# Altium schematic sheet 1166V30-1.SchDoc: 3 Phasen Motor-Modul
size A3; Author: M. Kutzsche; Organization: Kübrich Ing.-Gesellschaft; Address1: mbH & Co. KG; Address2: Weißmühle 10; Address3: D-96170 Priesendorf; DocumentNumber: UltraZohm; Revision: 30; SheetNumber: 1; SheetTotal: 5
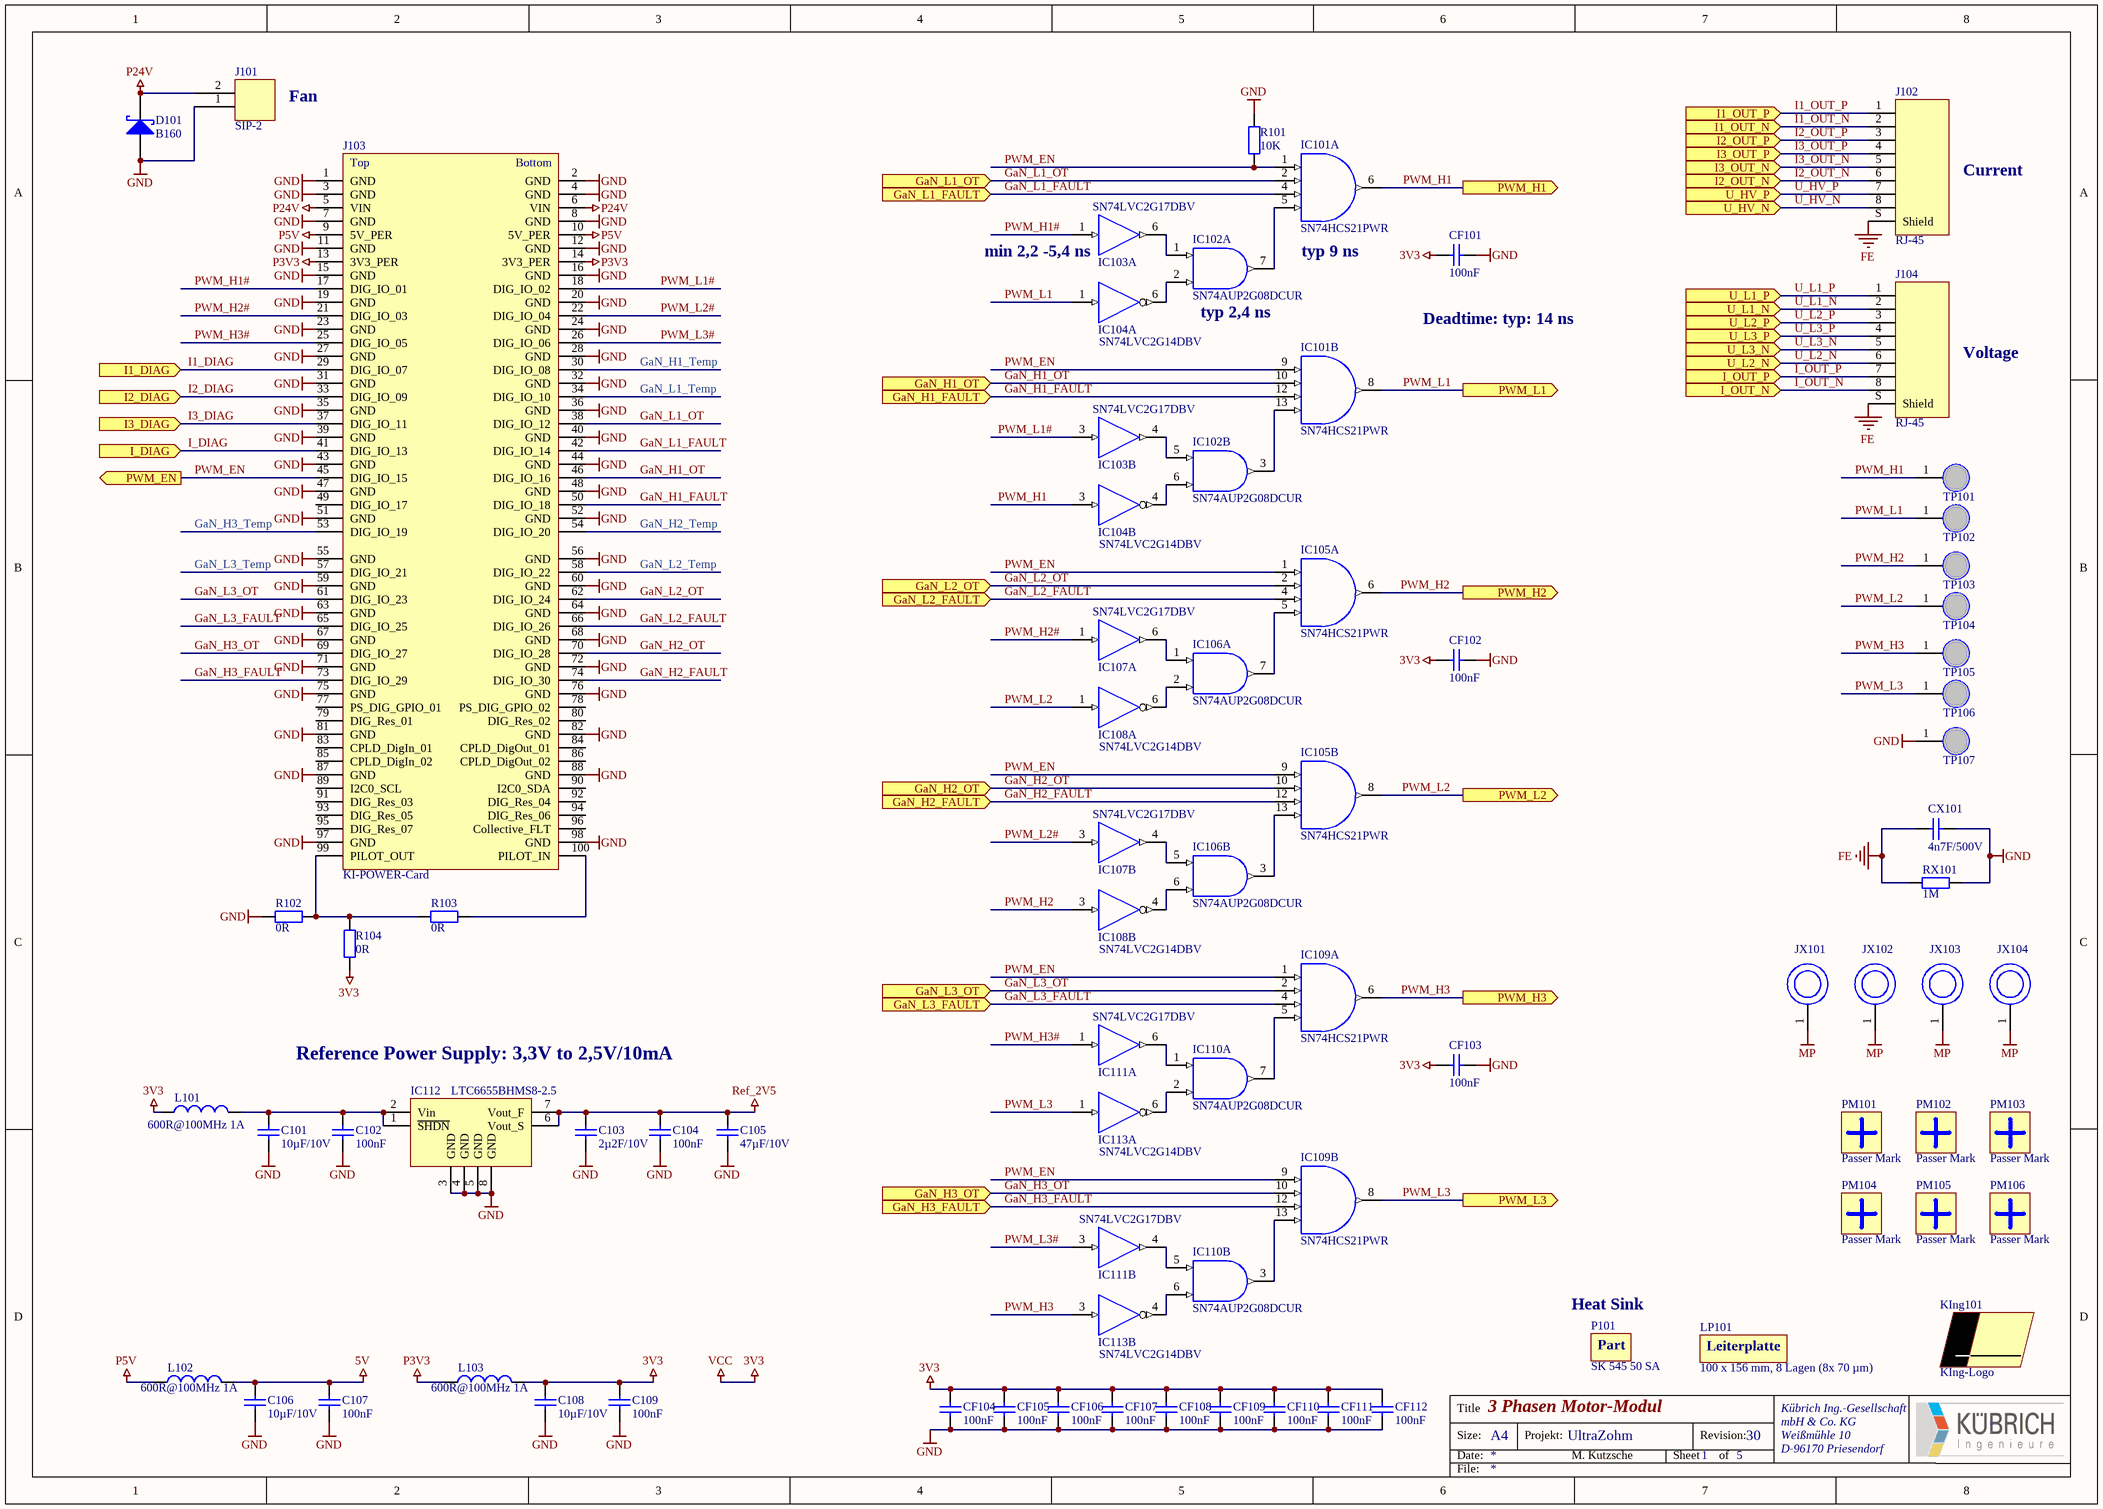
[diagram p0: 1166V30-1.SchDoc]

## Parts
C101  10µF/10V  [0805-Cap]
C102  100nF  [0603-Cap]
C103  2µ2F/10V  [0805-Cap]
C104  100nF  [0603-Cap]
C105  47µF/10V  [1210-Cap]
C106  10µF/10V  [0603-Cap]
C107  100nF  [0603-Cap]
C108  10µF/10V  [0603-Cap]
C109  100nF  [0603-Cap]
CF101  100nF  [0603-Cap]
CF102  100nF  [0603-Cap]
CF103  100nF  [0603-Cap]
CF104  100nF  [0603-Cap]
CF105  100nF  [0603-Cap]
CF106  100nF  [0603-Cap]
CF107  100nF  [0603-Cap]
CF108  100nF  [0603-Cap]
CF109  100nF  [0603-Cap]
CF110  100nF  [0603-Cap]
CF111  100nF  [0603-Cap]
CF112  100nF  [0603-Cap]
CX101  4n7F/500V  [1206-Cap]
D101  B160  [SMA]
IC101  SN74HCS21PWR  [TSSOP-14]  (parts A,B of 2)
IC102  SN74AUP2G08DCUR  [VSSOP-8]  (parts A,B of 2)
IC103  SN74LVC2G17DBV  [SOT-23-6]  (parts A,B of 2)
IC104  SN74LVC2G14DBV  [SOT-23-6]  (parts A,B of 2)
IC105  SN74HCS21PWR  [TSSOP-14]  (parts A,B of 2)
IC106  SN74AUP2G08DCUR  [VSSOP-8]  (parts A,B of 2)
IC107  SN74LVC2G17DBV  [SOT-23-6]  (parts A,B of 2)
IC108  SN74LVC2G14DBV  [SOT-23-6]  (parts A,B of 2)
IC109  SN74HCS21PWR  [TSSOP-14]  (parts A,B of 2)
IC110  SN74AUP2G08DCUR  [VSSOP-8]  (parts A,B of 2)
IC111  SN74LVC2G17DBV  [SOT-23-6]  (parts A,B of 2)
IC112  LTC6655BHMS8-2.5  [MSOP-8 (RM-8)]
IC113  SN74LVC2G14DBV  [SOT-23-6]  (parts A,B of 2)
J101  SIP-2  [SIP-2]
J102  RJ-45  [WE-634008149821]
J103  KI-POWER-Card  [KI-POWER-CARD]
J104  RJ-45  [WE-634008149821]
JX101  Drill PAD  [PAD-6.0/3.2]  (value not drawn)  (no BOM)
JX102  Drill PAD  [PAD-6.0/3.2]  (value not drawn)  (no BOM)
JX103  Drill PAD  [PAD-6.0/3.2]  (value not drawn)  (no BOM)
JX104  Drill PAD  [PAD-6.0/3.2]  (value not drawn)  (no BOM)
KIng101  KIng-Logo  [King_Logo 900x300mil short]  (no BOM)
L101  600R@100MHz 1A  [0603-Ind]
L102  600R@100MHz 1A  [0603-Ind]
L103  600R@100MHz 1A  [0603-Ind]
LP101  100 x 156 mm, 8 Lagen (8x 70 µm)  [LP]
P101  SK 545 50 SA  [Part]
PM101  Passer Mark  [PASSER-MARK Rund 1,2mm]
PM102  Passer Mark  [PASSER-MARK Rund 1,2mm]
PM103  Passer Mark  [PASSER-MARK Rund 1,2mm]
PM104  Passer Mark  [PASSER-MARK Rund 1,2mm]
PM105  Passer Mark  [PASSER-MARK Rund 1,2mm]
PM106  Passer Mark  [PASSER-MARK Rund 1,2mm]
R101  10K  [0603-Res]
R102  0R  [0603-Res]
R103  0R  [0603-Res]
R104  0R  [0603-Res]
RX101  1M  [1206-Res]
TP101  Test-Point  [PAD-1.0/1.8]  (value not drawn)  (no BOM)
TP102  Test-Point  [PAD-1.0/1.8]  (value not drawn)  (no BOM)
TP103  Test-Point  [PAD-1.0/1.8]  (value not drawn)  (no BOM)
TP104  Test-Point  [PAD-1.0/1.8]  (value not drawn)  (no BOM)
TP105  Test-Point  [PAD-1.0/1.8]  (value not drawn)  (no BOM)
TP106  Test-Point  [PAD-1.0/1.8]  (value not drawn)  (no BOM)
TP107  Test-Point  [PAD-1.0/1.8]  (value not drawn)  (no BOM)

## Ports
GaN_H1_FAULT (in), GaN_H1_OT (in), GaN_H2_FAULT (in), GaN_H2_OT (in), GaN_H3_FAULT (in), GaN_H3_OT (in), GaN_L1_FAULT (in), GaN_L1_OT (in), GaN_L2_FAULT (in), GaN_L2_OT (in), GaN_L3_FAULT (in), GaN_L3_OT (in), I1_DIAG (in), I1_OUT_N (in), I1_OUT_P (in), I2_DIAG (in), I2_OUT_N (in), I2_OUT_P (in), I3_DIAG (in), I3_OUT_N (in), I3_OUT_P (in), I_DIAG (in), I_OUT_N (in), I_OUT_P (in), PWM_EN (out), PWM_H1 (out), PWM_H2 (out), PWM_H3 (out), PWM_L1 (out), PWM_L2 (out), PWM_L3 (out), U_HV_N (in), U_HV_P (in), U_L1_N (in), U_L1_P (in), U_L2_N (in), U_L2_P (in), U_L3_N (in), U_L3_P (in)

## Nets
3V3: C108.2 C109.2 CF101.2 CF102.2 CF103.2 CF104.1 CF105.1 CF106.1 CF107.1 CF108.1 CF109.1 CF110.1 CF111.1 CF112.1 IC101.14(VCC) IC102.8(VCC) IC103.5(VCC) IC104.5(VCC) IC105.14(VCC) IC106.8(VCC) IC107.5(VCC) IC108.5(VCC) IC109.14(VCC) IC110.8(VCC) IC111.5(VCC) IC113.5(VCC) L101.1 L103.2 R104.1  [also labelled VCC]
5V: C106.2 C107.2 L102.2
FE: CX101.1 J102.S(Shield) J104.S(Shield) RX101.1
GND: C101.1 C102.1 C103.1 C104.1 C105.1 C106.1 C107.1 C108.1 C109.1 CF101.1 CF102.1 CF103.1 CF104.2 CF105.2 CF106.2 CF107.2 CF108.2 CF109.2 CF110.2 CF111.2 CF112.2 CX101.2 D101.1(A) IC101.7(GND) IC102.4(GND) IC103.2(GND) IC104.2(GND) IC105.7(GND) IC106.4(GND) IC107.2(GND) IC108.2(GND) IC109.7(GND) IC110.4(GND) IC111.2(GND) IC112.3(GND) IC112.4(GND) IC112.5(GND) IC112.8(GND) IC113.2(GND) J101.1 J103.1(GND) J103.2(GND) J103.3(GND) J103.4(GND) J103.7(GND) J103.8(GND) J103.11(GND) J103.12(GND) J103.15(GND) J103.16(GND) J103.19(GND) J103.20(GND) J103.23(GND) J103.24(GND) J103.27(GND) J103.28(GND) J103.31(GND) J103.32(GND) J103.35(GND) J103.36(GND) J103.39(GND) J103.40(GND) J103.43(GND) J103.44(GND) J103.47(GND) J103.48(GND) J103.51(GND) J103.52(GND) J103.55(GND) J103.56(GND) J103.59(GND) J103.60(GND) J103.63(GND) J103.64(GND) J103.67(GND) J103.68(GND) J103.71(GND) J103.72(GND) J103.75(GND) J103.76(GND) J103.81(GND) J103.82(GND) J103.87(GND) J103.88(GND) J103.97(GND) J103.98(GND) R101.2 R102.1 RX101.2 TP107.1
MP: JX101.1 JX102.1 JX103.1 JX104.1
P3V3: J103.13(3V3_PER) J103.14(3V3_PER) L103.1
P5V: J103.9(5V_PER) J103.10(5V_PER) L102.1
P24V: D101.2(K) J101.2 J103.5(VIN) J103.6(VIN)
Ref_2V5: C103.2 C104.2 C105.2 IC112.6(Vout_S) IC112.7(Vout_F)
GaN_H1_FAULT: IC101.12(C2) J103.50(DIG_IO_18) ; port GaN_H1_FAULT
GaN_H1_OT: IC101.10(B2) J103.46(DIG_IO_16) ; port GaN_H1_OT
GaN_H1_Temp: J103.30(DIG_IO_08)
GaN_H2_FAULT: IC105.12(C2) J103.74(DIG_IO_30) ; port GaN_H2_FAULT
GaN_H2_OT: IC105.10(B2) J103.70(DIG_IO_28) ; port GaN_H2_OT
GaN_H2_Temp: J103.54(DIG_IO_20)
GaN_H3_FAULT: IC109.12(C2) J103.73(DIG_IO_29) ; port GaN_H3_FAULT
GaN_H3_OT: IC109.10(B2) J103.69(DIG_IO_27) ; port GaN_H3_OT
GaN_H3_Temp: J103.53(DIG_IO_19)
GaN_L1_FAULT: IC101.4(C1) J103.42(DIG_IO_14) ; port GaN_L1_FAULT
GaN_L1_OT: IC101.2(B1) J103.38(DIG_IO_12) ; port GaN_L1_OT
GaN_L1_Temp: J103.34(DIG_IO_10)
GaN_L2_FAULT: IC105.4(C1) J103.66(DIG_IO_26) ; port GaN_L2_FAULT
GaN_L2_OT: IC105.2(B1) J103.62(DIG_IO_24) ; port GaN_L2_OT
GaN_L2_Temp: J103.58(DIG_IO_22)
GaN_L3_FAULT: IC109.4(C1) J103.65(DIG_IO_25) ; port GaN_L3_FAULT
GaN_L3_OT: IC109.2(B1) J103.61(DIG_IO_23) ; port GaN_L3_OT
GaN_L3_Temp: J103.57(DIG_IO_21)
I1_DIAG: J103.29(DIG_IO_07) ; port I1_DIAG
I1_OUT_N: J102.2 ; port I1_OUT_N
I1_OUT_P: J102.1 ; port I1_OUT_P
I2_DIAG: J103.33(DIG_IO_09) ; port I2_DIAG
I2_OUT_N: J102.6 ; port I2_OUT_N
I2_OUT_P: J102.3 ; port I2_OUT_P
I3_DIAG: J103.37(DIG_IO_11) ; port I3_DIAG
I3_OUT_N: J102.5 ; port I3_OUT_N
I3_OUT_P: J102.4 ; port I3_OUT_P
I_DIAG: J103.41(DIG_IO_13) ; port I_DIAG
I_OUT_N: J104.8 ; port I_OUT_N
I_OUT_P: J104.7 ; port I_OUT_P
PWM_EN: IC101.1(A1) IC101.9(A2) IC105.1(A1) IC105.9(A2) IC109.1(A1) IC109.9(A2) J103.45(DIG_IO_15) R101.1 ; port PWM_EN
PWM_H1: IC101.6(O1) IC104.3(2A) TP101.1 ; port PWM_H1
PWM_H1#: IC103.1(1A) J103.17(DIG_IO_01)
PWM_H2: IC105.6(O1) IC108.3(2A) TP103.1 ; port PWM_H2
PWM_H2#: IC107.1(1A) J103.21(DIG_IO_03)
PWM_H3: IC109.6(O1) IC113.3(2A) TP105.1 ; port PWM_H3
PWM_H3#: IC111.1(1A) J103.25(DIG_IO_05)
PWM_L1: IC101.8(O2) IC104.1(1A) TP102.1 ; port PWM_L1
PWM_L1#: IC103.3(2A) J103.18(DIG_IO_02)
PWM_L2: IC105.8(O2) IC108.1(1A) TP104.1 ; port PWM_L2
PWM_L2#: IC107.3(2A) J103.22(DIG_IO_04)
PWM_L3: IC109.8(O2) IC113.1(1A) TP106.1 ; port PWM_L3
PWM_L3#: IC111.3(2A) J103.26(DIG_IO_06)
U_HV_N: J102.8 ; port U_HV_N
U_HV_P: J102.7 ; port U_HV_P
U_L1_N: J104.2 ; port U_L1_N
U_L1_P: J104.1 ; port U_L1_P
U_L2_N: J104.6 ; port U_L2_N
U_L2_P: J104.3 ; port U_L2_P
U_L3_N: J104.5 ; port U_L3_N
U_L3_P: J104.4 ; port U_L3_P
NetC101_2: C101.2 C102.2 IC112.1(~{SHDN}) IC112.2(Vin) L101.2
NetIC101_5: IC101.5(D1) IC102.7(1Y)
NetIC101_13: IC101.13(D2) IC102.3(2Y)
NetIC102_1: IC102.1(1A) IC103.6(1Y)
NetIC102_2: IC102.2(1B) IC104.6(1Y)
NetIC102_5: IC102.5(2A) IC103.4(2Y)
NetIC102_6: IC102.6(2B) IC104.4(2Y)
NetIC105_5: IC105.5(D1) IC106.7(1Y)
NetIC105_13: IC105.13(D2) IC106.3(2Y)
NetIC106_1: IC106.1(1A) IC107.6(1Y)
NetIC106_2: IC106.2(1B) IC108.6(1Y)
NetIC106_5: IC106.5(2A) IC107.4(2Y)
NetIC106_6: IC106.6(2B) IC108.4(2Y)
NetIC109_5: IC109.5(D1) IC110.7(1Y)
NetIC109_13: IC109.13(D2) IC110.3(2Y)
NetIC110_1: IC110.1(1A) IC111.6(1Y)
NetIC110_2: IC110.2(1B) IC113.6(1Y)
NetIC110_5: IC110.5(2A) IC111.4(2Y)
NetIC110_6: IC110.6(2B) IC113.4(2Y)
NetJ103_99: J103.99(PILOT_OUT) R102.2 R103.1 R104.2
NetJ103_100: J103.100(PILOT_IN) R103.2

Not connected (* = marked no-connect by the designer): J103 49(DIG_IO_17) 77(PS_DIG_GPIO_01) 78(PS_DIG_GPIO_02) 79(DIG_Res_01) 80(DIG_Res_02) 83(CPLD_DigIn_01) 84(CPLD_DigOut_01) 85(CPLD_DigIn_02) 86(CPLD_DigOut_02) 89(I2C0_SCL) 90(I2C0_SDA) 91(DIG_Res_03) 92(DIG_Res_04) 93(DIG_Res_05) 94(DIG_Res_06) 95(DIG_Res_07) 96(Collective_FLT)

## Notes on the sheet
- Fan
- Current
- (near IC103) min 2,2 -5,4 ns
- (near IC102) typ 2,4 ns
- typ 9 ns
- Deadtime: typ: 14 ns
- Voltage
- Reference Power Supply: 3,3V to 2,5V/10mA
- Heat Sink
- Title
- Size:
- Date:
- A4
- Projekt:
- Sheet
- Revision:
- of
- File:
- (in symbol KI-POWER-Card) Top; Bottom

## Library data of the parts
C101-C109 CF101-CF112 CX101 = Cap_SMD: Capacitor (SMD); Class I: Pasiv; Class II: Capacitor; Last edited: 20.11.2006 10:25
  C101 C106 C108: value: 10µF/10V
  C102 C104 C107 C109 CF101-CF112: value: 100nF
  C103: value: 2µ2F/10V
  C105: value: 47µF/10V
  CX101: value: 4n7F/500V
D101 = B160: Schottky Barrier Rectifier Vr=60V If=1A; Manufacturer: General Semiconductor; Class II: Schottky Earrier Rectifier Vr=60V If=1A; Class I: Discret; Package information: Unknown; Best.-Nr.: Farnell 145-6528RL; Datasheet: Ver. 7 Nov 2000; Package reference: DO-214AC (SMA)
IC101 IC105 IC109 = SN74HCS21PWR: Dual 4-Input AND Gate with Schmitt Trigger Input; Manufacturer: Texas Instrument; Package Information: Unknown; Class I: Logic; Best.-Nr.: DigiKey: 296-SN74HCS21PWRCT-ND; Datasheet: SCES200J; Package Reference: TSSOP-14; Class II: Gate
IC102 IC106 IC110 = SN74AUP2G08DCUR: (VSSOP) Dual 2-Input Positive AND Gate; Manufacturer: Texas Instrument; Package Information: Unknown; Class I: Logic; Datasheet: SCES193J, Rev. Sep 2003; Package Reference: VSSOP-8; Class II: Dual 2-Input Positive AND Gate
IC103 IC107 IC111 = SN74LVC2G17D_: Dual Buffer with Schmitt Trigger Input; Manufacturer: Texas Instrument; Class I: Logic; value121: SN74LVC2G17DCK; Best.-Nr.: Farnell 147-0776 (SOT23-6), 128-7569 (SC-70); Datasheet: SCES381E, Rev. Sep 2003; Class II: Dual Buffer with Schmitt Trigger Input; value111: SN74LVC2G17DBV; Last edited: 22.01.2007 11:08
IC104 IC108 IC113 = SN74LVC2G14D_: Dual Inverter with Schmitt Trigger Input; Manufacturer: Texas Instrument; Class I: Logic; value121: SN74LVC2G14DCK; Datasheet: SCES200J; Class II: Dual Inverter with Schmitt Trigger Input; value111: SN74LVC2G14DBV; Last edited: 22.01.2007 11:08
IC112 = LTC6655BHMS8-2.5: Voltage References 2,5V, 2ppm/°C, Low Noise 0,25ppm; Manufacturer: Linear Technology; Class I: Discret; Package information: Unknown; Best.-Nr.: Farnell 229-5508; Class II: Voltage References 2,5V, 2ppm/°C, Low Noise 0,25ppm; Datasheet: Unknown; Package reference: MSOP-8
J101 = SIP-2: Single In-line Connector 2 pin; Class I: Connectors; Class II: Single In-line Connector 2 pin; Last edited: 08.12.2006 17:09
J102 J104 = WE-634008149821: SMD CAT3 RJ-45 Connector; Manufacturer: Würth Elektronik; Class I: Connectors; Class II: RJ-45 Connector; Package reference: WE-634008149821; Datasheet: Unknown; Best.-Nr.: WE-634008149821
J103 = KI-POWER-Card: Einsteckkarte für KI-POWER Projekt (Ultra ZYNQ); Manufacturer: Samtec; Class I: Connectors; Best.-Nr.: Gegenstecker: Samtec HSEC8-150-01-XX-DV-A-BL; Class II: Einsteckkarte für KI-POWER Projekt (Ultra ZYNQ); Datasheet: 2000/1; Last edited: 07.09.2020 13:28
JX101-JX104 = Drill PAD: PAD
KIng101 = KIng-Logo: Kuebrich-Ing. Logo
L101-L103 = WE-742792651: Ferrite SMD 600R@100MHz 1A (0603); Manufacturer: Wuerth-Elektronik; Class I: Pasive; Class II: Ferrite SMD 600R@100MHz 1A; Last edited: 08.12.2006 12:28; Best.-Nr.: WE-742792651
LP101 = Leiterplatte: Leiterplatte 100 x 156 mm, 8 Lagen (8x 70 µm); Manufacturer: Generic Manufacturer; Footprint: Größe 100 x 156 mm
P101 = Part: Kühlkörper 80x50x10 mm; Manufacturer: Fischer Elektronik; Best.-Nr.: SK 545 50 SA
R101-R104 RX101 = Res_SMD: Resistor SMD; Class I: Pasiv; Class II: Resistor; Last edited: 17.11.2006 11:38
  R101: value: 10K
  R102-R104: value: 0R
  RX101: value: 1M
TP101-TP107 = Test-Point: PAD